# Altium schematic sheet SC8701_EVM_RE0.SchDoc: SC8701-EVM-RE0
size A3; Address1: Author: OldGerman; Address2: License: CC BY-SA 4.0; SheetNumber: 1; SheetTotal: 1
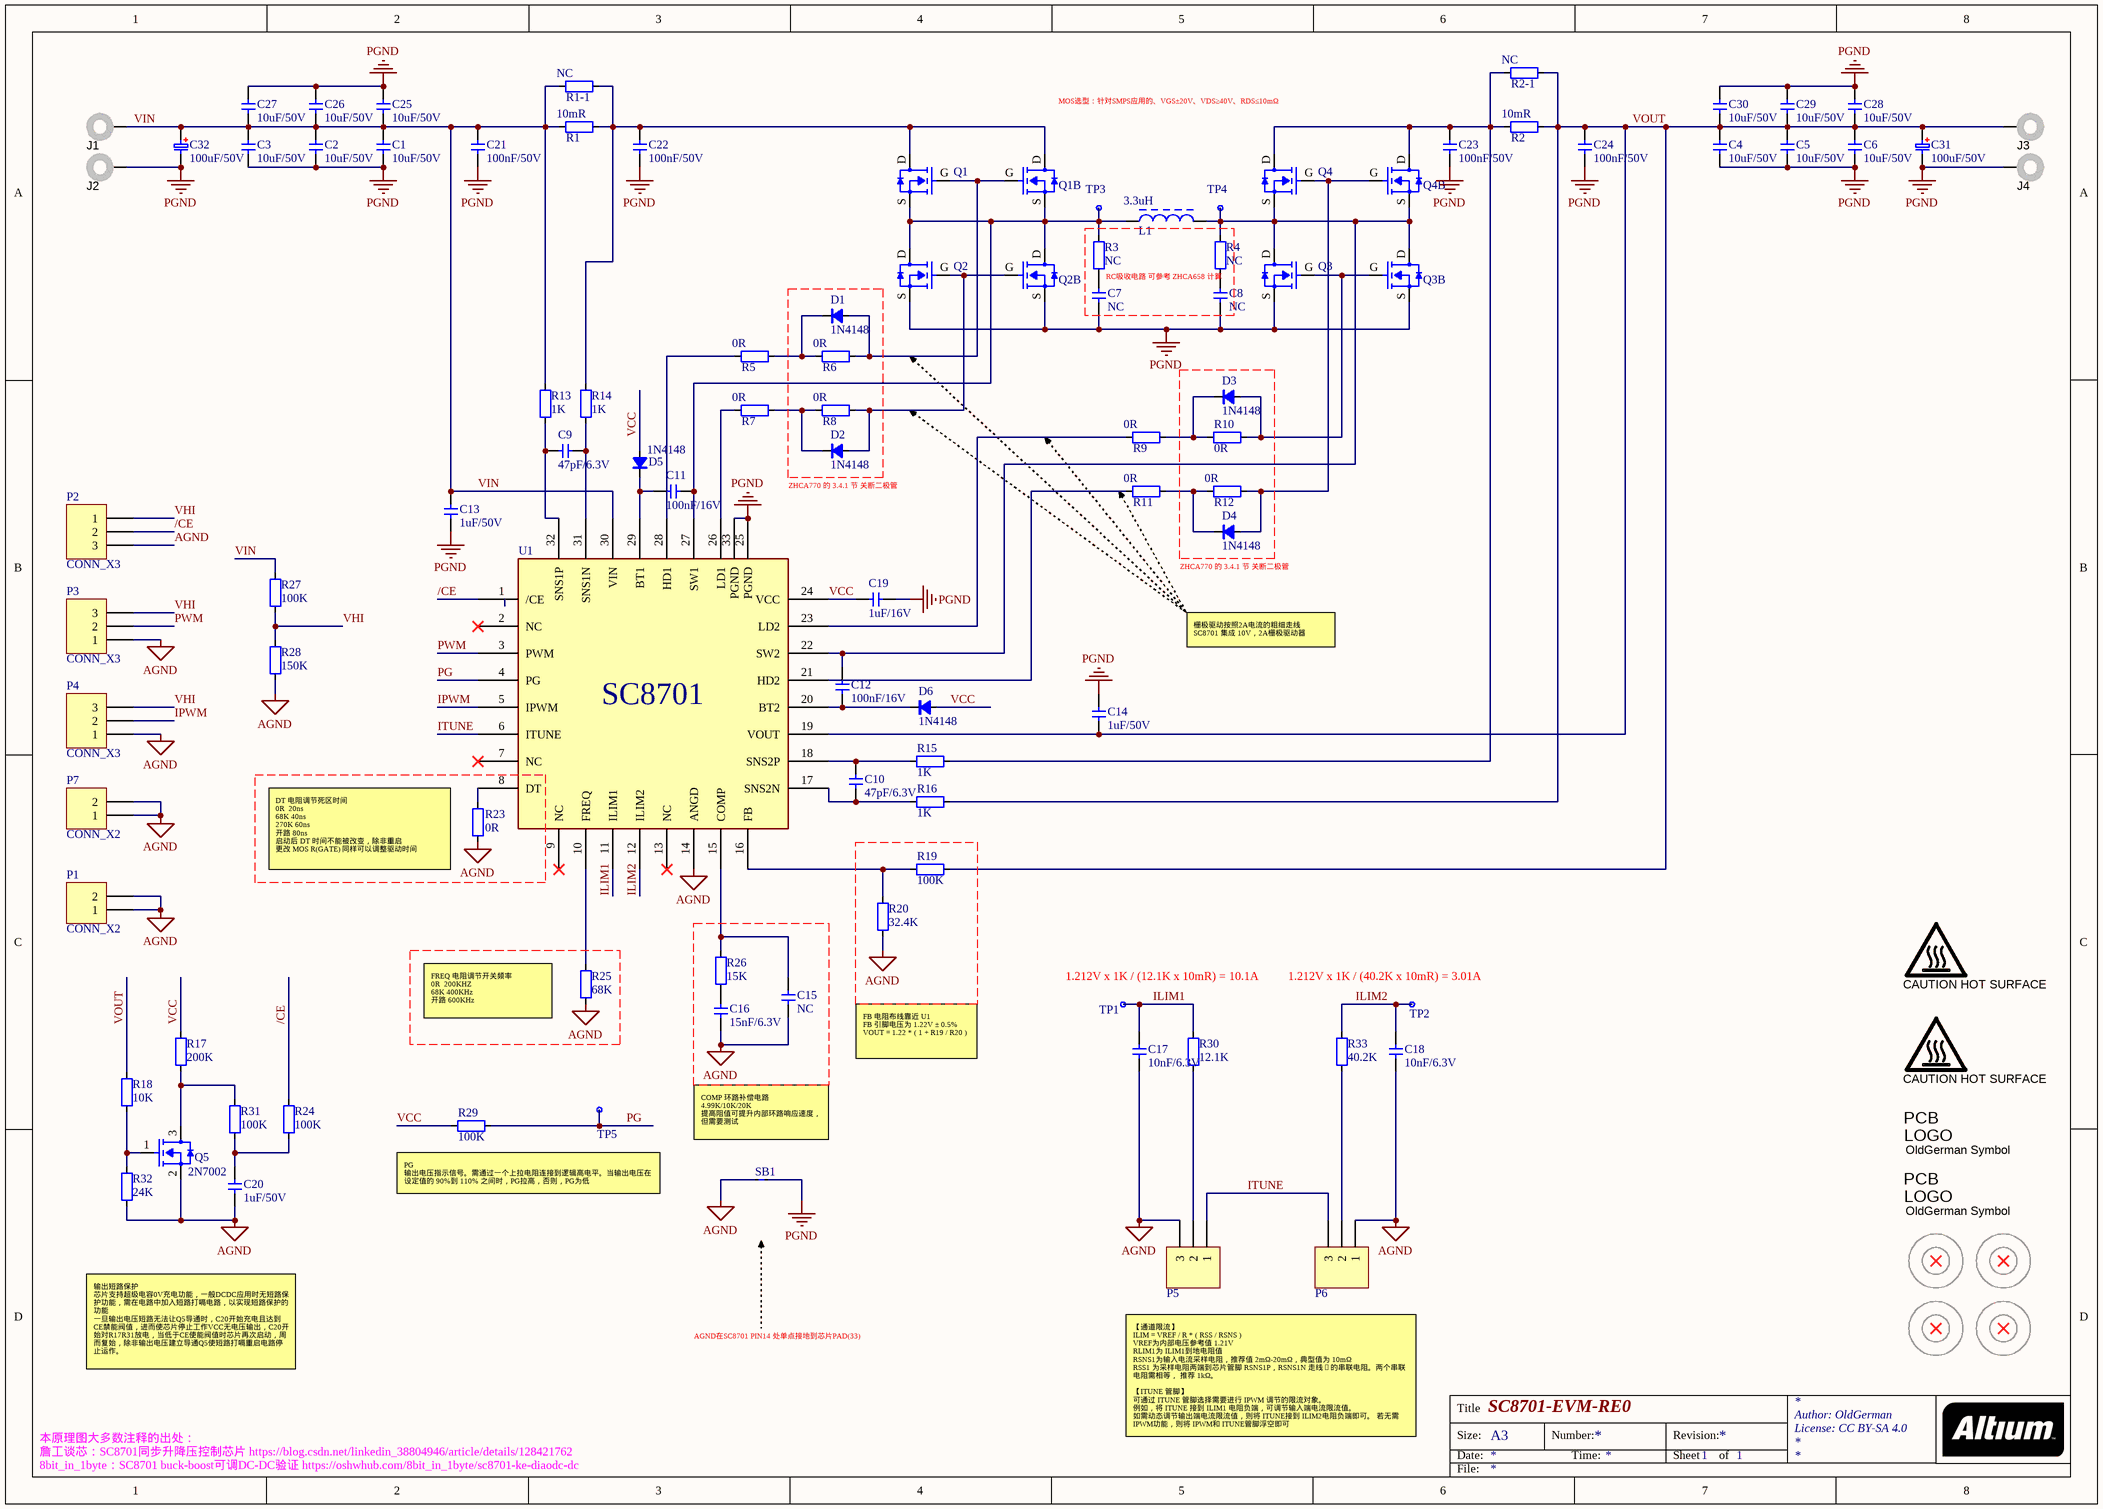
[diagram p0: SC8701_EVM_RE0.SchDoc]

## Parts
C1  10uF/50V  [C1206]
C2  10uF/50V  [C1206]
C3  10uF/50V  [C1206]
C4  10uF/50V  [C1206]
C5  10uF/50V  [C1206]
C6  10uF/50V  [C1206]
C7  NC  [C0603]
C8  NC  [C0603]
C9  47pF/6.3V  [C0603]
C10  47pF/6.3V  [C0603]
C11  100nF/16V  [C0603]
C12  100nF/16V  [C0603]
C13  1uF/50V  [C0603]
C14  1uF/50V  [C0603]
C15  NC  [C0603]
C16  15nF/6.3V  [C0603]
C17  10nF/6.3V  [C0603]
C18  10nF/6.3V  [C0603]
C19  1uF/16V  [C0603]
C20  1uF/50V  [C0603]
C21  100nF/50V  [C0603]
C22  100nF/50V  [C0603]
C23  100nF/50V  [C0603]
C24  100nF/50V  [C0603]
C25  10uF/50V  [C1206]
C26  10uF/50V  [C1206]
C27  10uF/50V  [C1206]
C28  10uF/50V  [C1206]
C29  10uF/50V  [C1206]
C30  10uF/50V  [C1206]
C31  100uF/50V  [CAP OS-CON D=10.0 L=10.0 F10]
C32  100uF/50V  [CAP OS-CON D=10.0 L=10.0 F10]
D1  1N4148  [SOD-323]
D2  1N4148  [SOD-323]
D3  1N4148  [SOD-323]
D4  1N4148  [SOD-323]
D5  1N4148  [SOD-323]
D6  1N4148  [SOD-323]
H1  HOLE  [M3.2 D=8]  (value not drawn)
H2  HOLE  [M3.2 D=8]  (value not drawn)
H3  HOLE  [M3.2 D=8]  (value not drawn)
H4  HOLE  [M3.2 D=8]  (value not drawn)
J1  U6047  [JACK_BANANA_U6047]  (value not drawn)
J2  U6047  [JACK_BANANA_U6047]  (value not drawn)
J3  U6047  [JACK_BANANA_U6047]  (value not drawn)
J4  U6047  [JACK_BANANA_U6047]  (value not drawn)
L1  3.3uH  [INDUCTOR 1350 12.6X13.5X5.0mm]
LOGO1  CAUTION HOT SURFACE  [IEC_HotSurface_Small]  (no BOM)
LOGO2  CAUTION HOT SURFACE  [IEC_HotSurface_Small]  (no BOM)
Logo3  OldGerman Symbol  [ODG_LOGO]  (no BOM)
Logo4  OldGerman Symbol  [ODG_LOGO]  (no BOM)
P1  CONN_X2  [2.54mm_Male_x2]
P2  CONN_X3  [2.54mm_Male_x3]
P3  CONN_X3  [2.54mm_Male_x3]
P4  CONN_X3  [2.54mm_Male_x3]
P5  CONN_X3  [2.54mm_Male_x3]  (value not drawn)
P6  CONN_X3  [2.54mm_Male_x3]  (value not drawn)
P7  CONN_X2  [2.54mm_Male_x2]
Q1  N-MOS_GDS  [SON 3X3 NexFET Q3]  (value not drawn)
Q1B  N-MOS_GDS  [SO8FL ROUND]  (value not drawn)
Q2  N-MOS_GDS  [SON 3X3 NexFET Q3]  (value not drawn)
Q2B  N-MOS_GDS  [SO8FL ROUND]  (value not drawn)
Q3  N-MOS_GDS  [SON 3X3 NexFET Q3]  (value not drawn)
Q3B  N-MOS_GDS  [SO8FL ROUND]  (value not drawn)
Q4  N-MOS_GDS  [SON 3X3 NexFET Q3]  (value not drawn)
Q4B  N-MOS_GDS  [SO8FL ROUND]  (value not drawn)
Q5  2N7002  [INFINEON SOT-23-3]
R1  10mR  [R1206]
R1-1  NC  [R1206]
R2  10mR  [R1206]
R2-1  NC  [R1206]
R3  NC  [R0805]
R4  NC  [R0805]
R5  0R  [R0603]
R6  0R  [R0603]
R7  0R  [R0603]
R8  0R  [R0603]
R9  0R  [R0603]
R10  0R  [R0603]
R11  0R  [R0603]
R12  0R  [R0603]
R13  1K  [R0603]
R14  1K  [R0603]
R15  1K  [R0603]
R16  1K  [R0603]
R17  200K  [R0603]
R18  10K  [R0603]
R19  100K  [R0603]
R20  32.4K  [R0603]
R23  0R  [R0603]
R24  100K  [R0603]
R25  68K  [R0603]
R26  15K  [R0603]
R27  100K  [R0603]
R28  150K  [R0603]
R29  100K  [R0603]
R30  12.1K  [R0603]
R31  100K  [R0603]
R32  24K  [R0603]
R33  40.2K  [R0603]
SB1  NetTie_200um  [NetTie_200um]  (value not drawn)  (net tie, no BOM)
TP1  CONN_X1_DOT  [2.54mm_Male_x1]  (value not drawn)
TP2  CONN_X1_DOT  [2.54mm_Male_x1]  (value not drawn)
TP3  CONN_X1_DOT  [2.54mm_Male_x1]  (value not drawn)
TP4  CONN_X1_DOT  [2.54mm_Male_x1]  (value not drawn)
TP5  CONN_X1_DOT  [2.54mm_Male_x1]  (value not drawn)
U1  SC8701 (A)  [TQFN-32 4X4MM 0.4 VIA]  (value not drawn)

## Nets
AGND: C15.1 C16.1 C17.1 C18.1 C20.2 P1.1 P1.2 P2.3 P3.1 P4.1 P5.3 P6.1 P7.1 P7.2 Q5.2(S) R20.1 R23.1 R25.1 R28.1 R32.1 SB1.1 U1.14(ANGD)
PGND: C1.1 C2.1 C3.1 C4.1 C5.1 C6.1 C7.1 C8.1 C13.2 C14.2 C19.2 C21.1 C22.1 C23.1 C24.1 C25.1 C26.1 C27.1 C28.1 C29.1 C30.1 C31.2 C32.2 J2.1 J4.1 Q2.S Q2B.S Q3.S Q3B.S SB1.2 U1.25(PGND) U1.33(PGND)
/CE: P2.2 R24.2 U1.1(/CE)
ILIM1: C17.2 R30.2 TP1.1 U1.11(ILIM1)
ILIM2: C18.2 R33.2 TP2.1 U1.12(ILIM2)
IPWM: P4.2 U1.5(IPWM)
ITUNE: P5.1 P6.3 U1.6(ITUNE)
PG: R29.2 TP5.1 U1.4(PG)
PWM: P3.2 U1.3(PWM)
VCC: C19.1 D5.1(A) D6.1(A) R17.2 R29.1 U1.24(VCC)
VHI: P2.1 P3.3 P4.3 R27.1 R28.2
VIN: C1.2 C2.2 C3.2 C13.1 C21.2 C25.2 C26.2 C27.2 C32.1 J1.1 R1.1 R1-1.1 R13.2 R27.2 U1.30(VIN)
VOUT: C4.2 C5.2 C6.2 C14.1 C24.2 C28.2 C29.2 C30.2 C31.1 J3.1 R2.2 R2-1.2 R16.1 R18.2 R19.2 U1.19(VOUT)
NetC7_2: C7.2 R3.1
NetC8_2: C8.2 R4.1
NetC9_1: C9.1 R13.1 U1.32(SNS1P)
NetC9_2: C9.2 R14.1 U1.31(SNS1N)
NetC10_1: C10.1 R15.2 U1.18(SNS2P)
NetC10_2: C10.2 R16.2 U1.17(SNS2N)
NetC11_1: C11.1 D5.2(C) U1.29(BT1)
NetC11_2: C11.2 L1.1 Q1.S Q1B.S Q2.D Q2B.D R3.2 TP3.1 U1.27(SW1)
NetC12_1: C12.1 L1.2 Q3.D Q3B.D Q4.S Q4B.S R4.2 TP4.1 U1.22(SW2)
NetC12_2: C12.2 D6.2(C) U1.20(BT2)
NetC15_2: C15.2 R26.2 U1.15(COMP)
NetC16_2: C16.2 R26.1
NetC20_1: C20.1 R24.1 R31.1
NetC22_2: C22.2 Q1.D Q1B.D R1.2 R1-1.2 R14.2
NetC23_2: C23.2 Q4.D Q4B.D R2.1 R2-1.1 R15.1
NetD1_1: D1.1(A) Q1.G Q1B.G R6.2
NetD1_2: D1.2(C) R5.2 R6.1
NetD2_1: D2.1(A) Q2.G Q2B.G R8.2
NetD2_2: D2.2(C) R7.2 R8.1
NetD3_1: D3.1(A) Q3.G Q3B.G R10.2
NetD3_2: D3.2(C) R9.2 R10.1
NetD4_1: D4.1(A) Q4.G Q4B.G R12.2
NetD4_2: D4.2(C) R11.2 R12.1
NetP5_2: P5.2 R30.1
NetP6_2: P6.2 R33.1
NetQ5_1: Q5.1(G) R18.1 R32.2
NetQ5_3: Q5.3(D) R17.1 R31.2
NetR5_1: R5.1 U1.28(HD1)
NetR7_1: R7.1 U1.26(LD1)
NetR9_1: R9.1 U1.23(LD2)
NetR11_1: R11.1 U1.21(HD2)
NetR19_1: R19.1 R20.2 U1.16(FB)
NetR23_2: R23.2 U1.8(DT)
NetR25_2: R25.2 U1.10(FREQ)

Not connected (* = marked no-connect by the designer): H1 1*; H2 1*; H3 1*; H4 1*; U1 2(NC)* 7(NC)* 9(NC)* 13(NC)*

## Notes on the sheet
- MOS选型：针对SMPS应用的、VGS±20V、VDS≥40V、RDS≤10mΩ
- RC吸收电路 可参考 ZHCA658 计算
- (near D2) ZHCA770 的 3.4.1 节 关断二极管
- (near D4) ZHCA770 的 3.4.1 节 关断二极管
- 栅极驱动按照2A电流的粗细走线
  SC8701 集成 10V，2A栅极驱动器
- (near R23) DT 电阻调节死区时间
  0R  20ns
  68K 40ns
  270K 60ns
  开路 80ns
  启动后 DT 时间不能被改变，除非重启
  更改 MOS R(GATE) 同样可以调整驱动时间
- (near TP1) 1.212V x 1K / (12.1K x 10mR) = 10.1A
- (near TP2) 1.212V x 1K / (40.2K x 10mR) = 3.01A
- (near R25) FREQ 电阻调节开关频率
  0R  200KHZ
  68K 400KHz
  开路 600KHz
- FB 电阻布线靠近 U1
  FB 引脚电压为 1.22V ± 0.5%
  VOUT = 1.22 * ( 1 + R19 / R20 )
- PG
  输出电压指示信号。需通过一个上拉电阻连接到逻辑高电平。当输出电压在设定值的 90%到 110% 之间时，PG拉高，否则，PG为低
- (near SB1) COMP 环路补偿电路
  4.99K/10K/20K
  提高阻值可提升内部环路响应速度，但需要测试
- 输出短路保护
  芯片支持超级电容0V充电功能，一般DCDC应用时无短路保护功能，需在电路中加入短路打嗝电路，以实现短路保护的功能
  一旦输出电压短路无法让Q5导通时，C20开始充电且达到CE禁能阀值，进而使芯片停止工作VCC无电压输出，C20开始对R17R31放电，当低于CE使能阀值时芯片再次启动，周而复始，除非输出电压建立导通Q5使短路打嗝重启电路停止运作。
- AGND在SC8701 PIN14 处单点接地到芯片PAD(33)
- 【通道限流】
  ILIM = VREF / R * ( RSS / RSNS )
  VREF为内部电压参考值 1.21V
  RLIM1为 ILIM1到地电阻值
  RSNS1为输入电流采样电阻，推荐值 2mΩ-20mΩ，典型值为 10mΩ
  RSS1 为采样电阻两端到芯片管脚 RSNS1P，RSNS1N 走线的串联电阻。两个串联电阻需相等， 推荐 1kΩ。
  【ITUNE 管脚】
  可通过 ITUNE 管脚选择需要进行 IPWM 调节的限流对象。
  例如，将 ITUNE 接到 ILIM1 电阻负端，可调节输入端电流限流值。
  如需动态调节输出端电流限流值，则将 ITUNE接到 ILIM2电阻负端即可。 若无需 IPWM功能，则将 IPWM和 ITUNE管脚浮空即可
- 本原理图大多数注释的出处：
  詹工谈芯：SC8701同步升降压控制芯片 https://blog.csdn.net/linkedin_38804946/article/details/128421762
  8bit_in_1byte：SC8701 buck-boost可调DC-DC验证 https://oshwhub.com/8bit_in_1byte/sc8701-ke-diaodc-dc
- Title
- Size:
- Date:
- A3
- Number:
- Time:
- Revision:
- Sheet
- of
- File:
- (in symbol OldGeman) PCB; LOGO
- (in symbol SC8701 (A)) SC8701

## Library data of the parts
C1-C30 = CAP: Capacitor
C31 C32 = CAP_Polar_Aluminum: Capacitor
D1-D6 = Diode: 二极管
J1-J4 = JACK_BANANA: Banana Jack; PartNumber: 575-8; Manufacturer: Keystone; CompType: Connector; U/M: EA; RoHS: Y; PackageReference: Keystone575-8; MountType: TH; ComponentLink1Description: Datasheet Link; ComponentLink1URL: http://www.keyelco.com/pdfs/M55p95.pdf; Publisher: Texas Instruments; LatestRevisionDate: 2015-08-25; Supplier 1: Digi-Key; Supplier Part Number 1: 36-575-8-ND
L1 = Inductor_power: 135 功率电感 额定电流15A
LOGO1 LOGO2 = IEC_HotSurface: IEC 61010-1 Hot Surface Warning; SymbolCreator: a0412235; SymbolVersion: 2011-08-22; Published: 2009-03-03; Publisher: Texas Instruments; LatestRevisionDate: 2014-11-20
Logo3 Logo4 = OldGeman: SymbolCreator: a0412235; SymbolVersion: 2011-08-22; Published: 2009-03-03; Publisher: Texas Instruments; LatestRevisionDate: 2014-11-20
Q5 = N-MOS_123: N-MOS
R1 R1-1 R2 R2-1 R3-R20 R23-R33 = RES: IEC Standard
SB1 = NetTie 0.2mm: Net Tie; Artikkelnr Noca: N.A.; Pad Count: 2; Part Number: NetTie 0.2mm; ComponentLink1Description: Datasheet; ComponentLink2Description: Supplier link; Footprint Doc: NetTie; LatestRevisionDate: 2019-10-07; Pin Count: 2; Publisher: Nordic Semiconductor; Published: 2019-10-07; Value: NetTie_200um; Part number IPS: N.A.; Component Class: Connectors; PartId: 100500654
U1 = SC8701 (A): 高效率, 同步, 4 管升降压控制器